# Altium schematic sheet Header.SchDoc
size A4
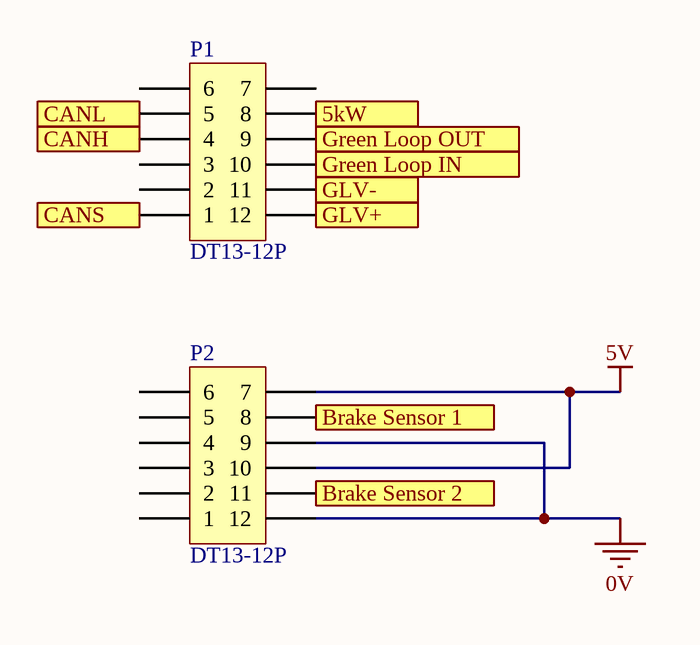
[diagram p0: Header.SchDoc]

## Parts
P1  DT13-12P  [DT13-12P]
P2  DT13-12P  [DT13-12P]

## Ports
5kW, Brake Sensor 1, Brake Sensor 2, CANH, CANL, CANS, GLV+, GLV-, Green Loop IN, Green Loop OUT

## Nets
0V: P2.9 P2.12
5V: P2.7 P2.10
5kW: P1.8 ; port 5kW
Brake Sensor 1: P2.8 ; port Brake Sensor 1
Brake Sensor 2: P2.11 ; port Brake Sensor 2
CANH: P1.4 ; port CANH
CANL: P1.5 ; port CANL
CANS: P1.1 ; port CANS
GLV+: P1.12 ; port GLV+
GLV-: P1.11 ; port GLV-
Green Loop IN: P1.10 ; port Green Loop IN
Green Loop OUT: P1.9 ; port Green Loop OUT

Not connected (* = marked no-connect by the designer): P1 2 3 6 7; P2 1 2 3 4 5 6

## Library data of the parts
P1 P2 = DT13-12P[[/\]]DT13-12P: Positions: 12; Pitch: 4.44mm; Row Spacing: 6.35mm; Angle: 90; Flange: Yes; Contact: Nickel; Part Number: DT13-12P; Digikey Part Number: 1734-1451-ND; Digikey Link: https://www.digikey.com.au/product-detail/en/te-connectivity-deutsch-connectors/DT13-12PA/1734-1451-ND/7220123